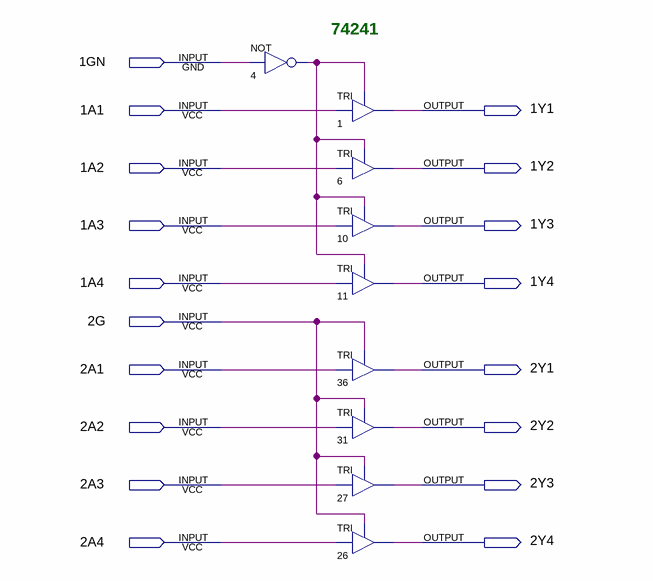
[diagram p0: schematic sheet]
// Quartus schematic 74241.bdf as structural Verilog: 9 symbols, 18 pins
module \74241  (
  input  \1GN ,
  input  \1A1 ,
  input  \1A2 ,
  input  \1A3 ,
  input  \1A4 ,
  input  \2G ,
  input  \2A1 ,
  input  \2A2 ,
  input  \2A3 ,
  input  \2A4 ,
  output \1Y1 ,
  output \1Y2 ,
  output \1Y3 ,
  output \1Y4 ,
  output \2Y1 ,
  output \2Y2 ,
  output \2Y3 ,
  output \2Y4 
);

  wire n4_out;

  not u_4 (n4_out, \1GN );
  TRI u_1 (.IN(\1A1 ), .OE(n4_out), .OUT(\1Y1 ));
  TRI u_6 (.IN(\1A2 ), .OE(n4_out), .OUT(\1Y2 ));
  TRI u_10 (.IN(\1A3 ), .OE(n4_out), .OUT(\1Y3 ));
  TRI u_11 (.IN(\1A4 ), .OE(n4_out), .OUT(\1Y4 ));
  TRI u_36 (.IN(\2A1 ), .OE(\2G ), .OUT(\2Y1 ));
  TRI u_31 (.IN(\2A2 ), .OE(\2G ), .OUT(\2Y2 ));
  TRI u_27 (.IN(\2A3 ), .OE(\2G ), .OUT(\2Y3 ));
  TRI u_26 (.IN(\2A4 ), .OE(\2G ), .OUT(\2Y4 ));

  // Notes on the sheet:
  //   74241
endmodule
